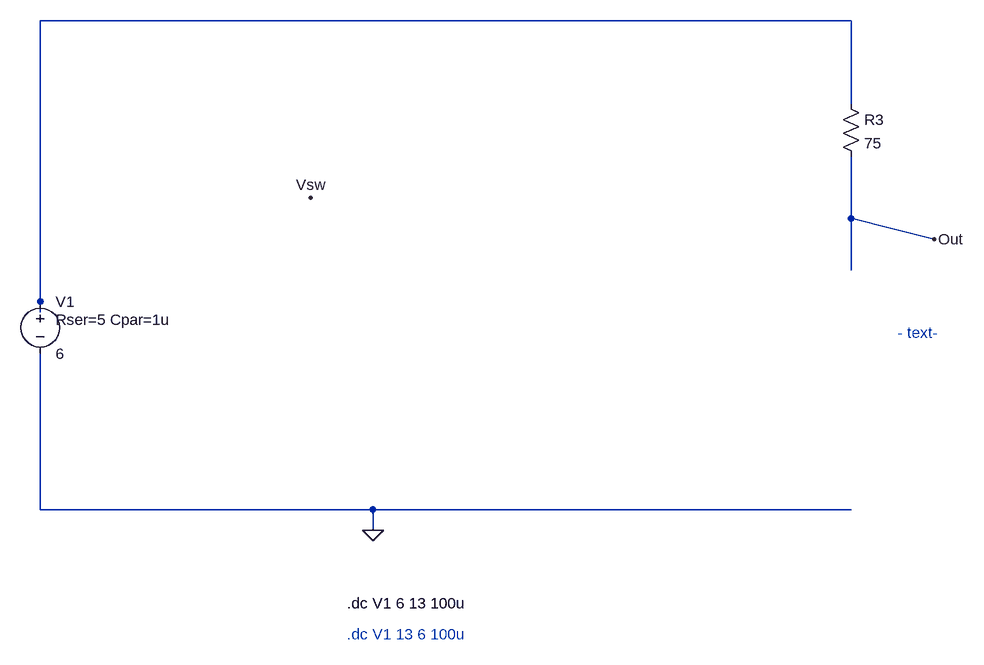
[diagram p0: schematic V0_SW.asc]
V0_SW.asc, the LTspice schematic file:
Version 4
SHEET 1 1032 680
WIRE 832 -384 -416 -384
WIRE 832 -256 832 -384
WIRE 832 -80 832 -176
WIRE 960 -48 832 -80
WIRE 832 0 832 -80
WIRE -416 48 -416 -384
WIRE -416 64 -416 48
WIRE -416 368 -416 128
WIRE 96 368 -416 368
WIRE 832 368 96 368
WIRE 96 400 96 368
FLAG 96 400 0
FLAG 960 -48 Out
FLAG 0 -112 Vsw
SYMBOL res 816 -272 R0
SYMATTR InstName R3
SYMATTR Value 75
SYMBOL voltage -416 32 R0
WINDOW 123 0 0 Left 0
WINDOW 39 24 44 Left 2
SYMATTR SpiceLine Rser=5 Cpar=1u
SYMATTR InstName V1
SYMATTR Value 6
TEXT 56 512 Left 2 !.dc V1 6 13 100u
TEXT 904 96 Left 2 ;- text-
TEXT 56 560 Left 2 ;.dc V1 13 6 100u

The netlist it stands for:
* V0_SW.asc
R3 N001 Out 75
V1 N001 0 6 Rser=5 Cpar=1u
.dc V1 6 13 100u
* - text-
* .dc V1 13 6 100u
.backanno
.end